# EAGLE schematic ESP32 Display-1.28-V1.0 (EAGLE 9.6.2)
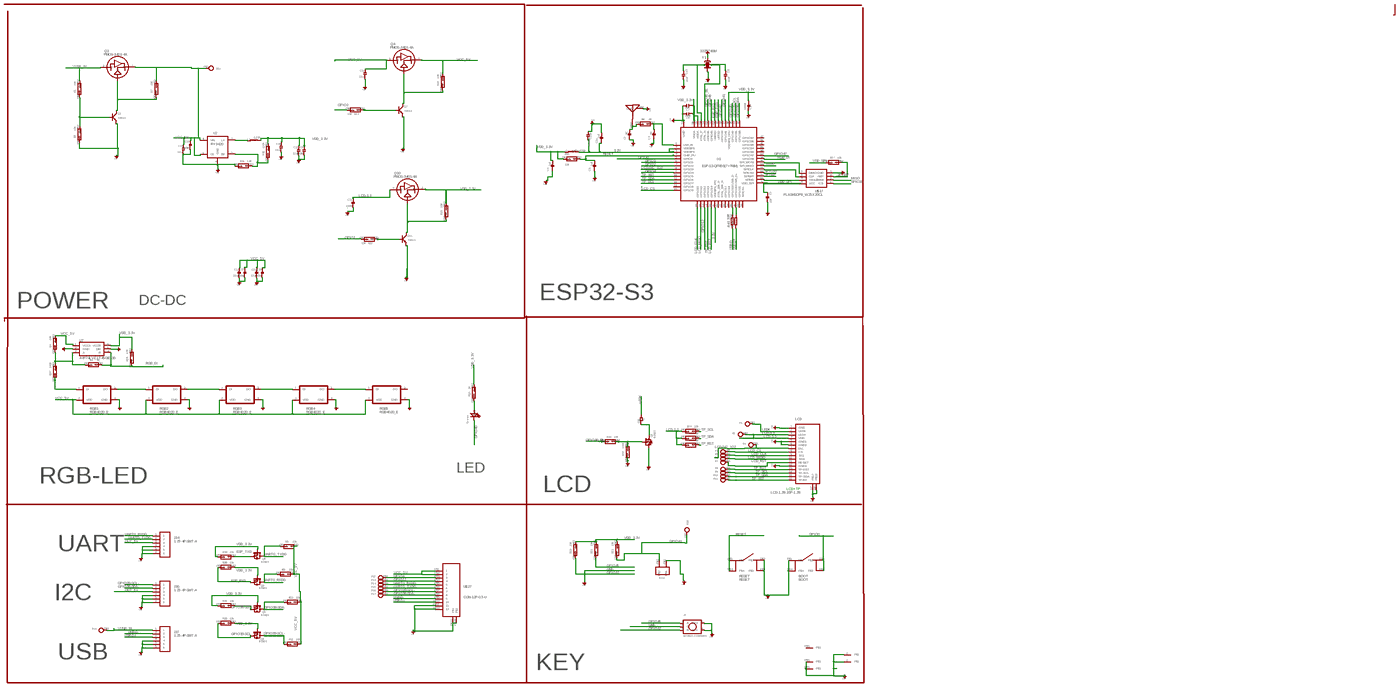
[diagram p0: schematic, sheet 1, overview]
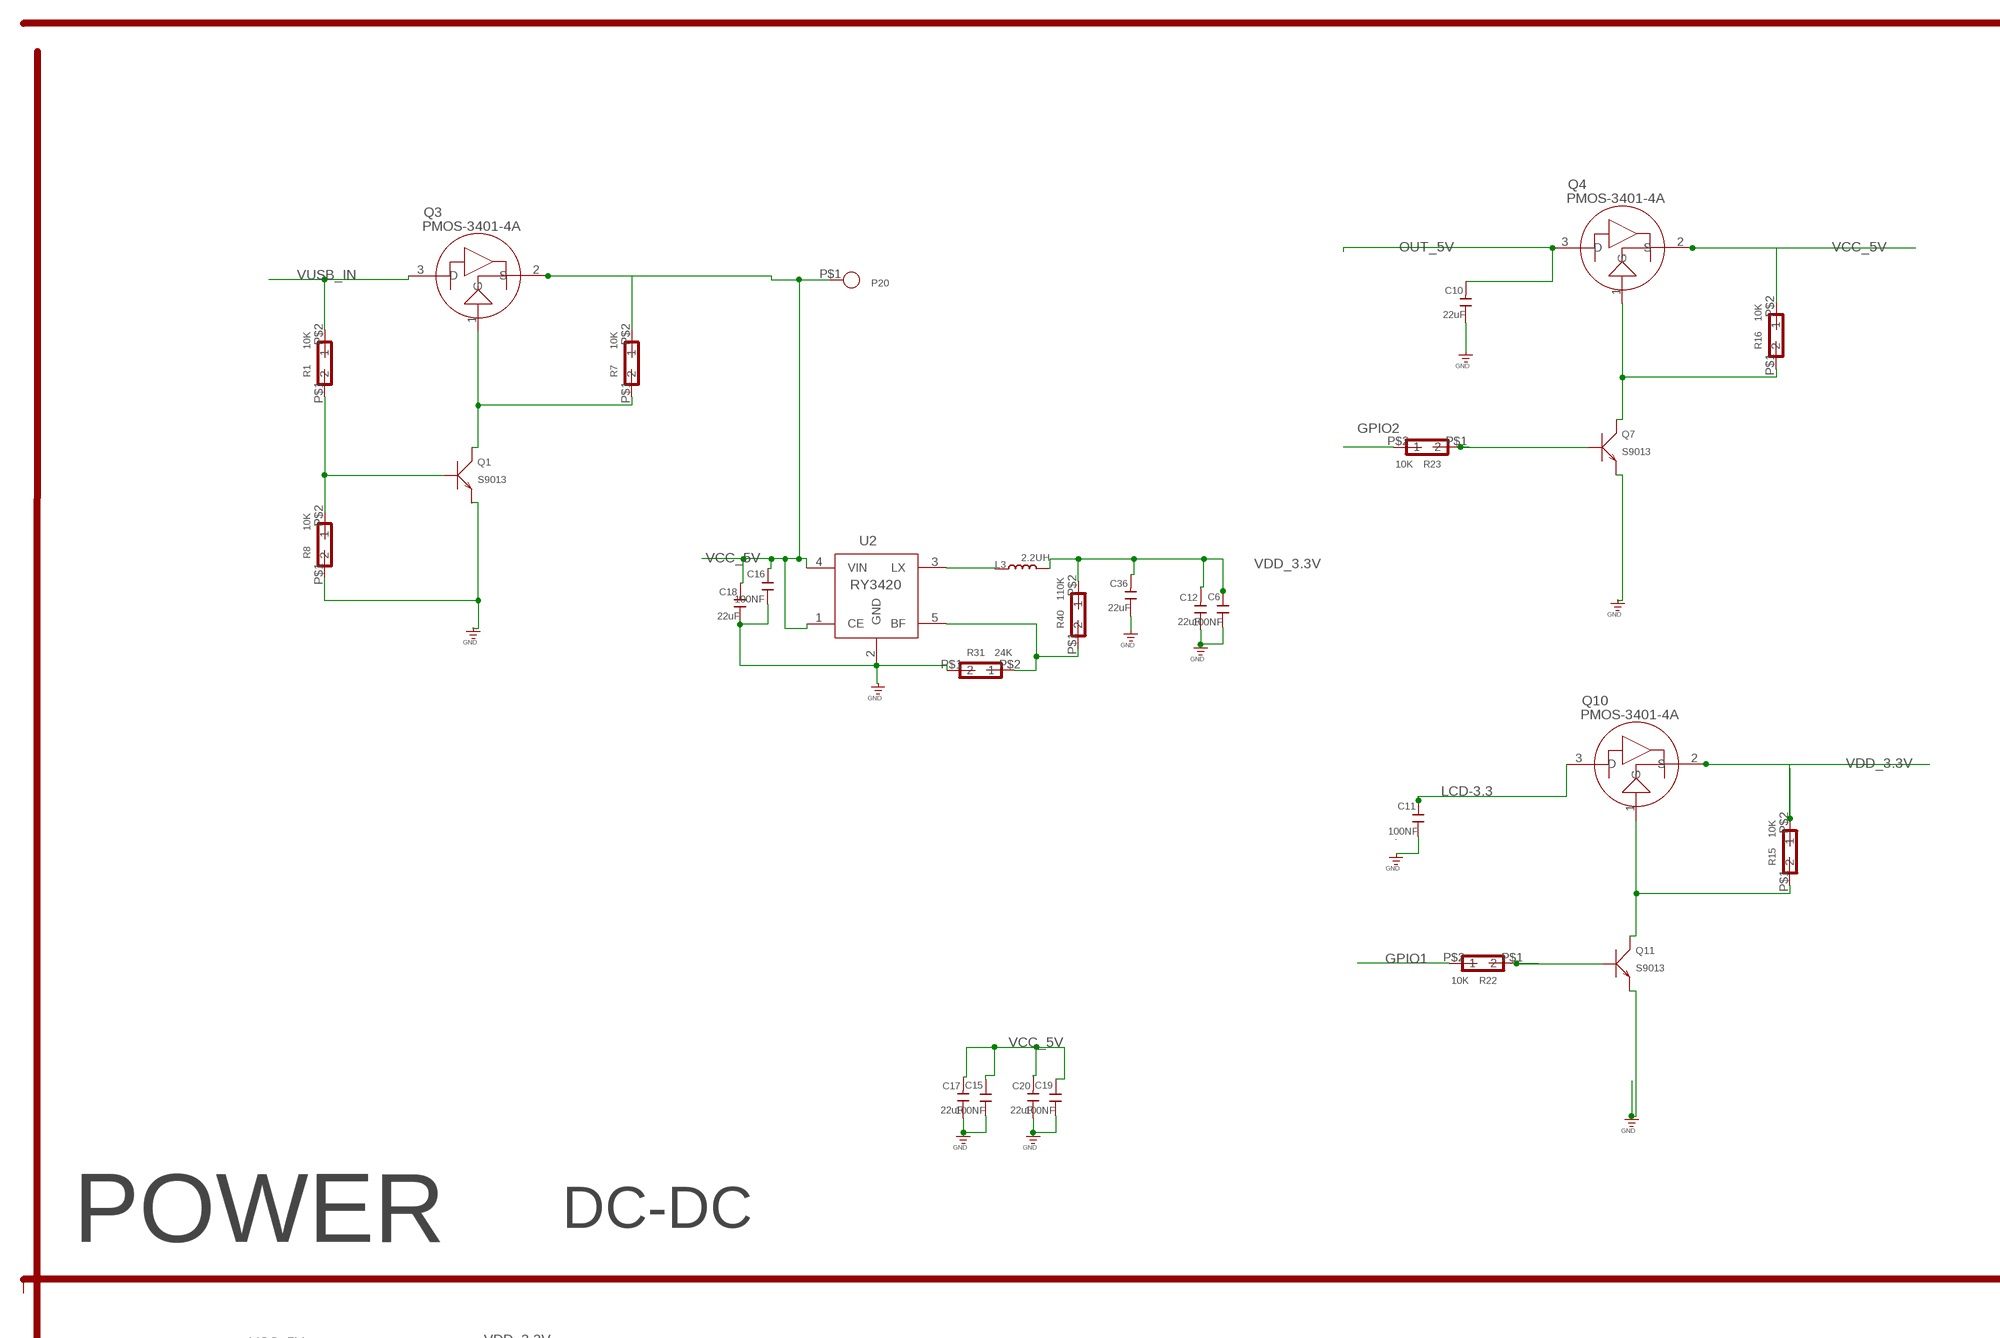
[diagram p1: schematic, sheet 1, part 1 of 5]
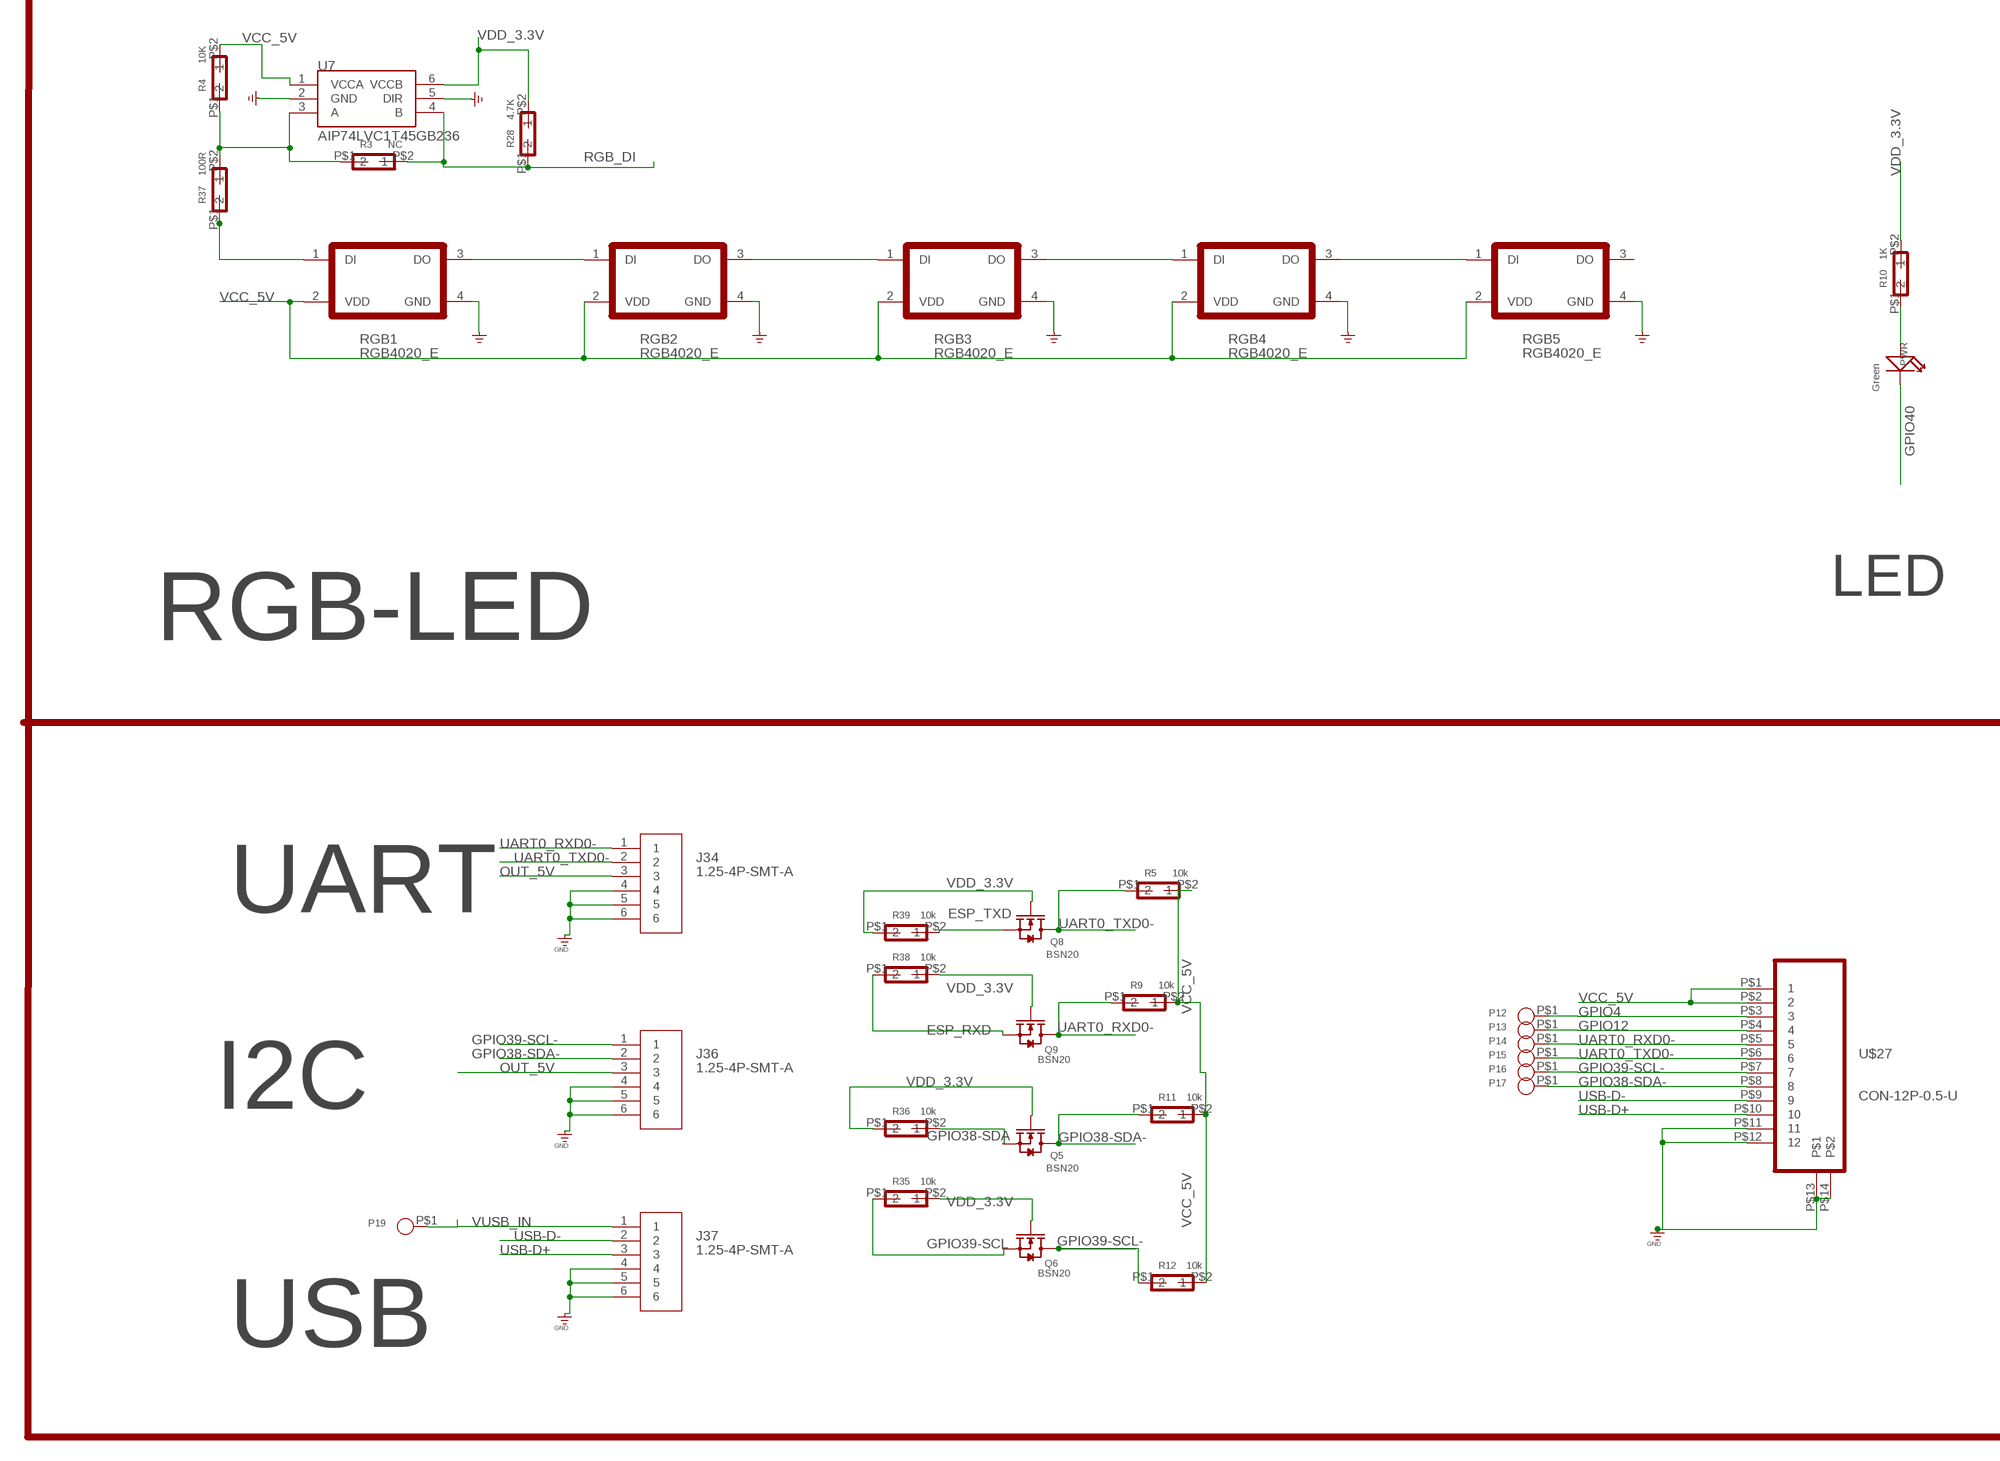
[diagram p2: schematic, sheet 1, part 2 of 5]
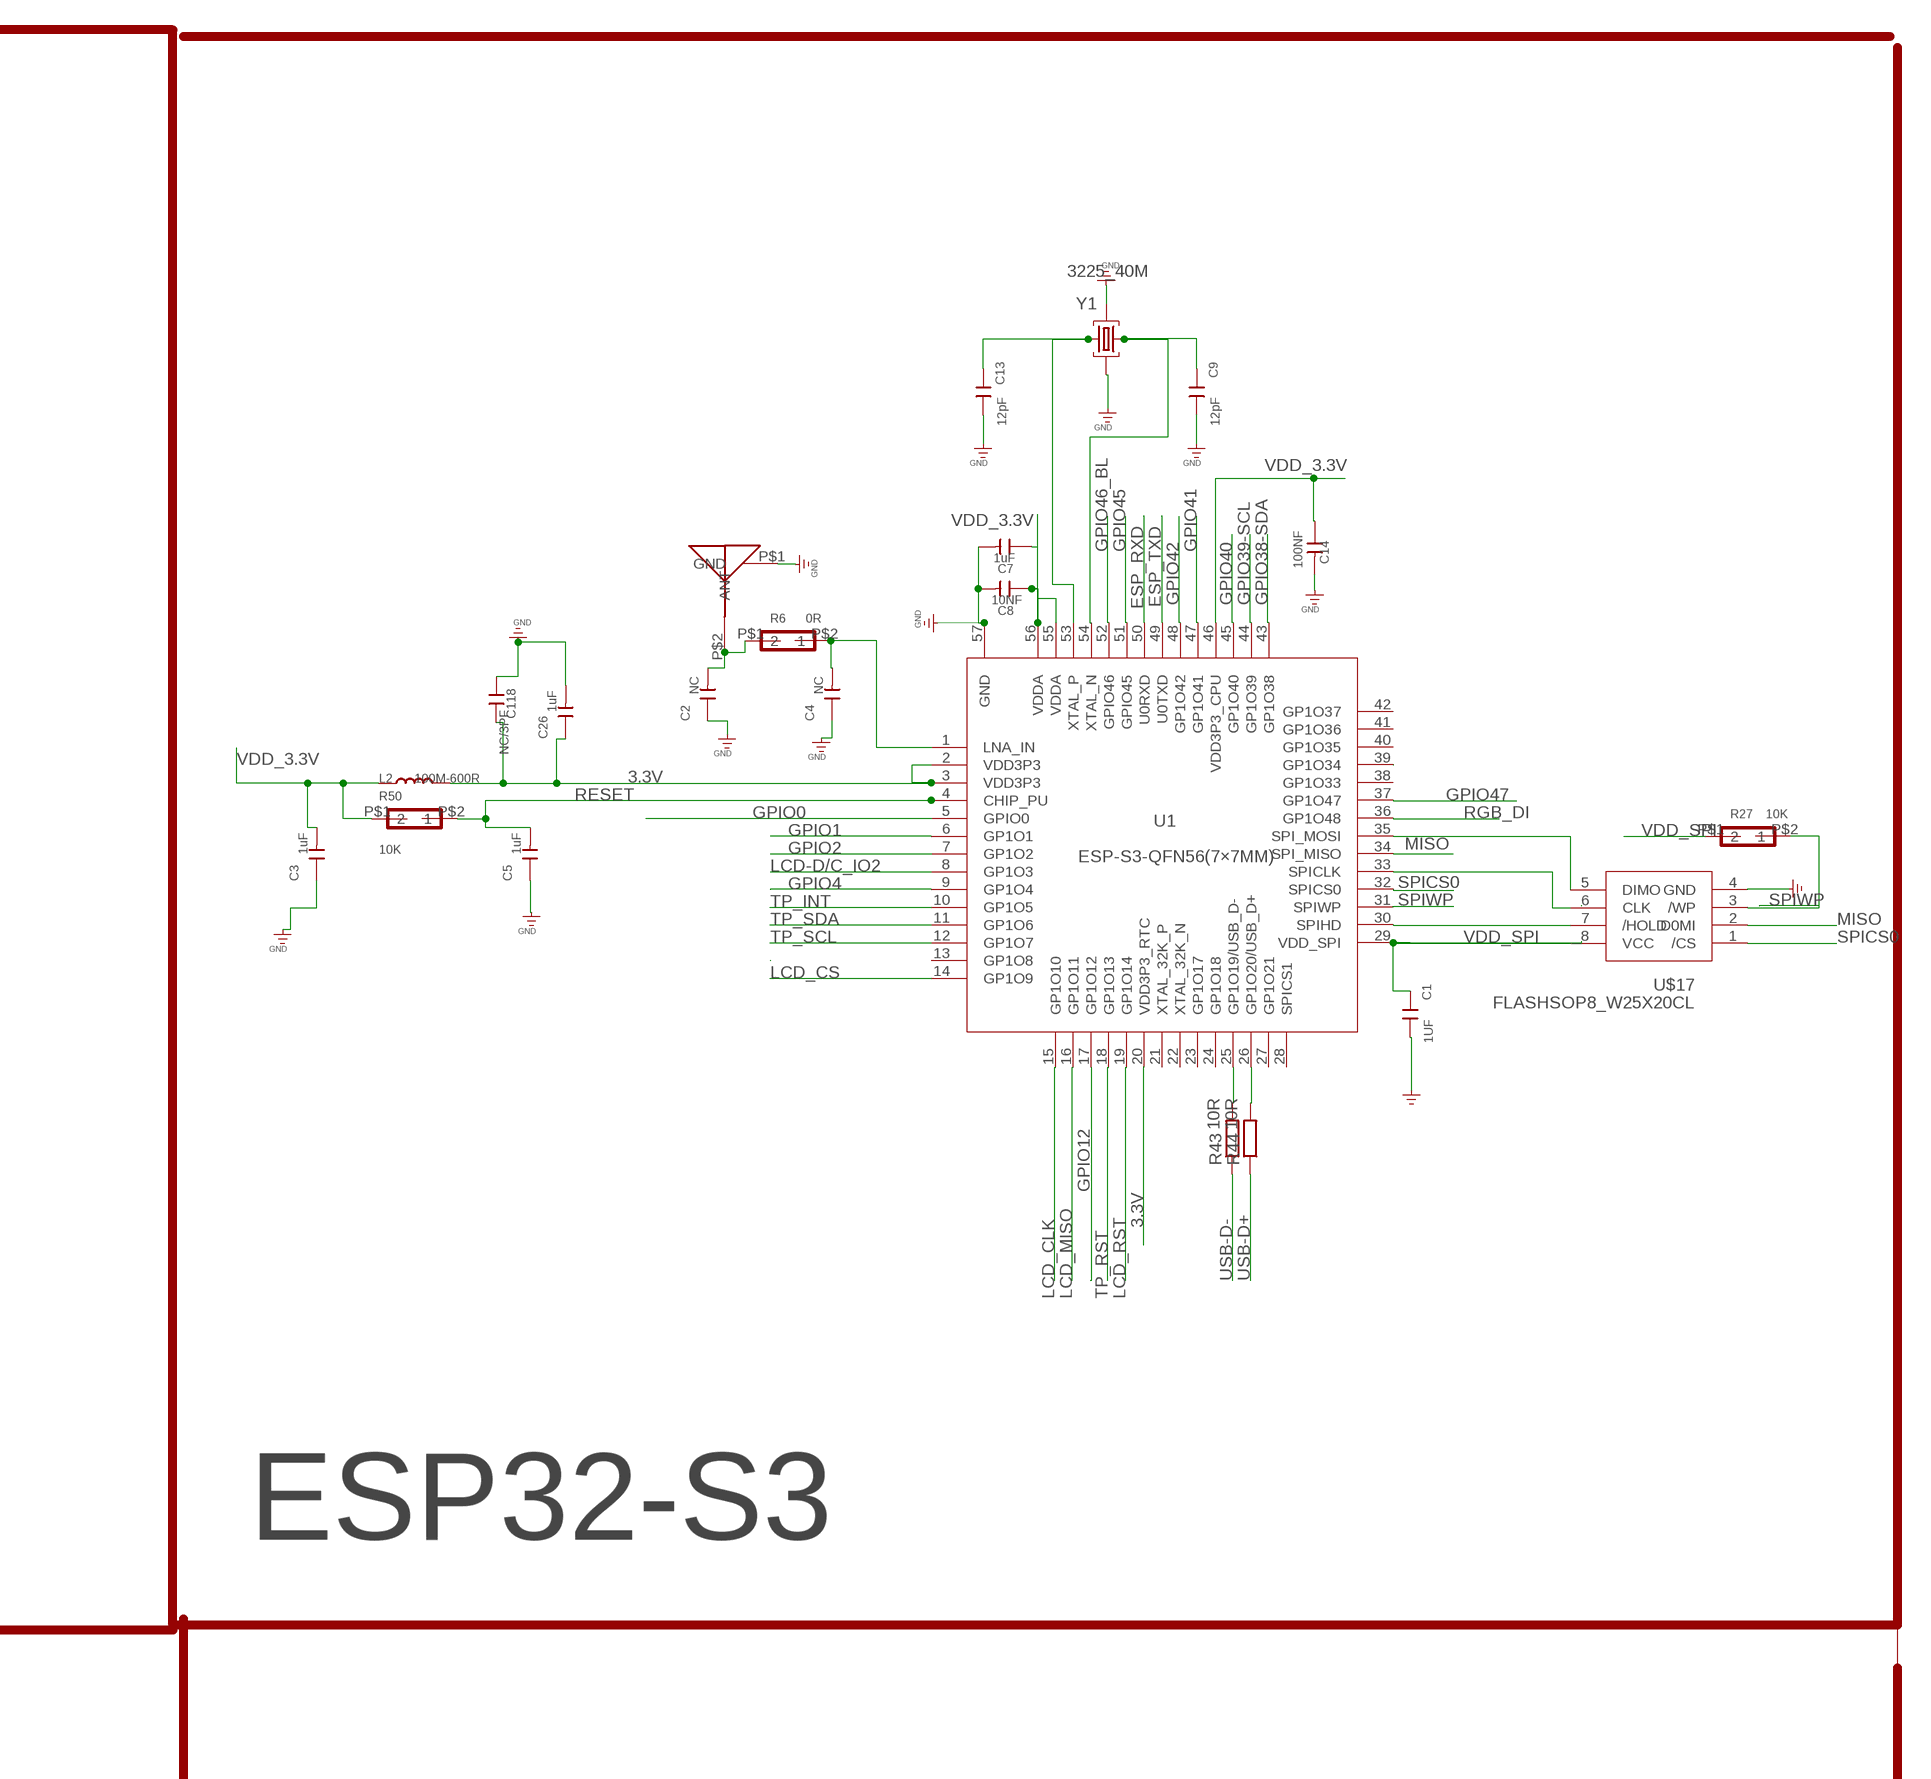
[diagram p3: schematic, sheet 1, part 3 of 5]
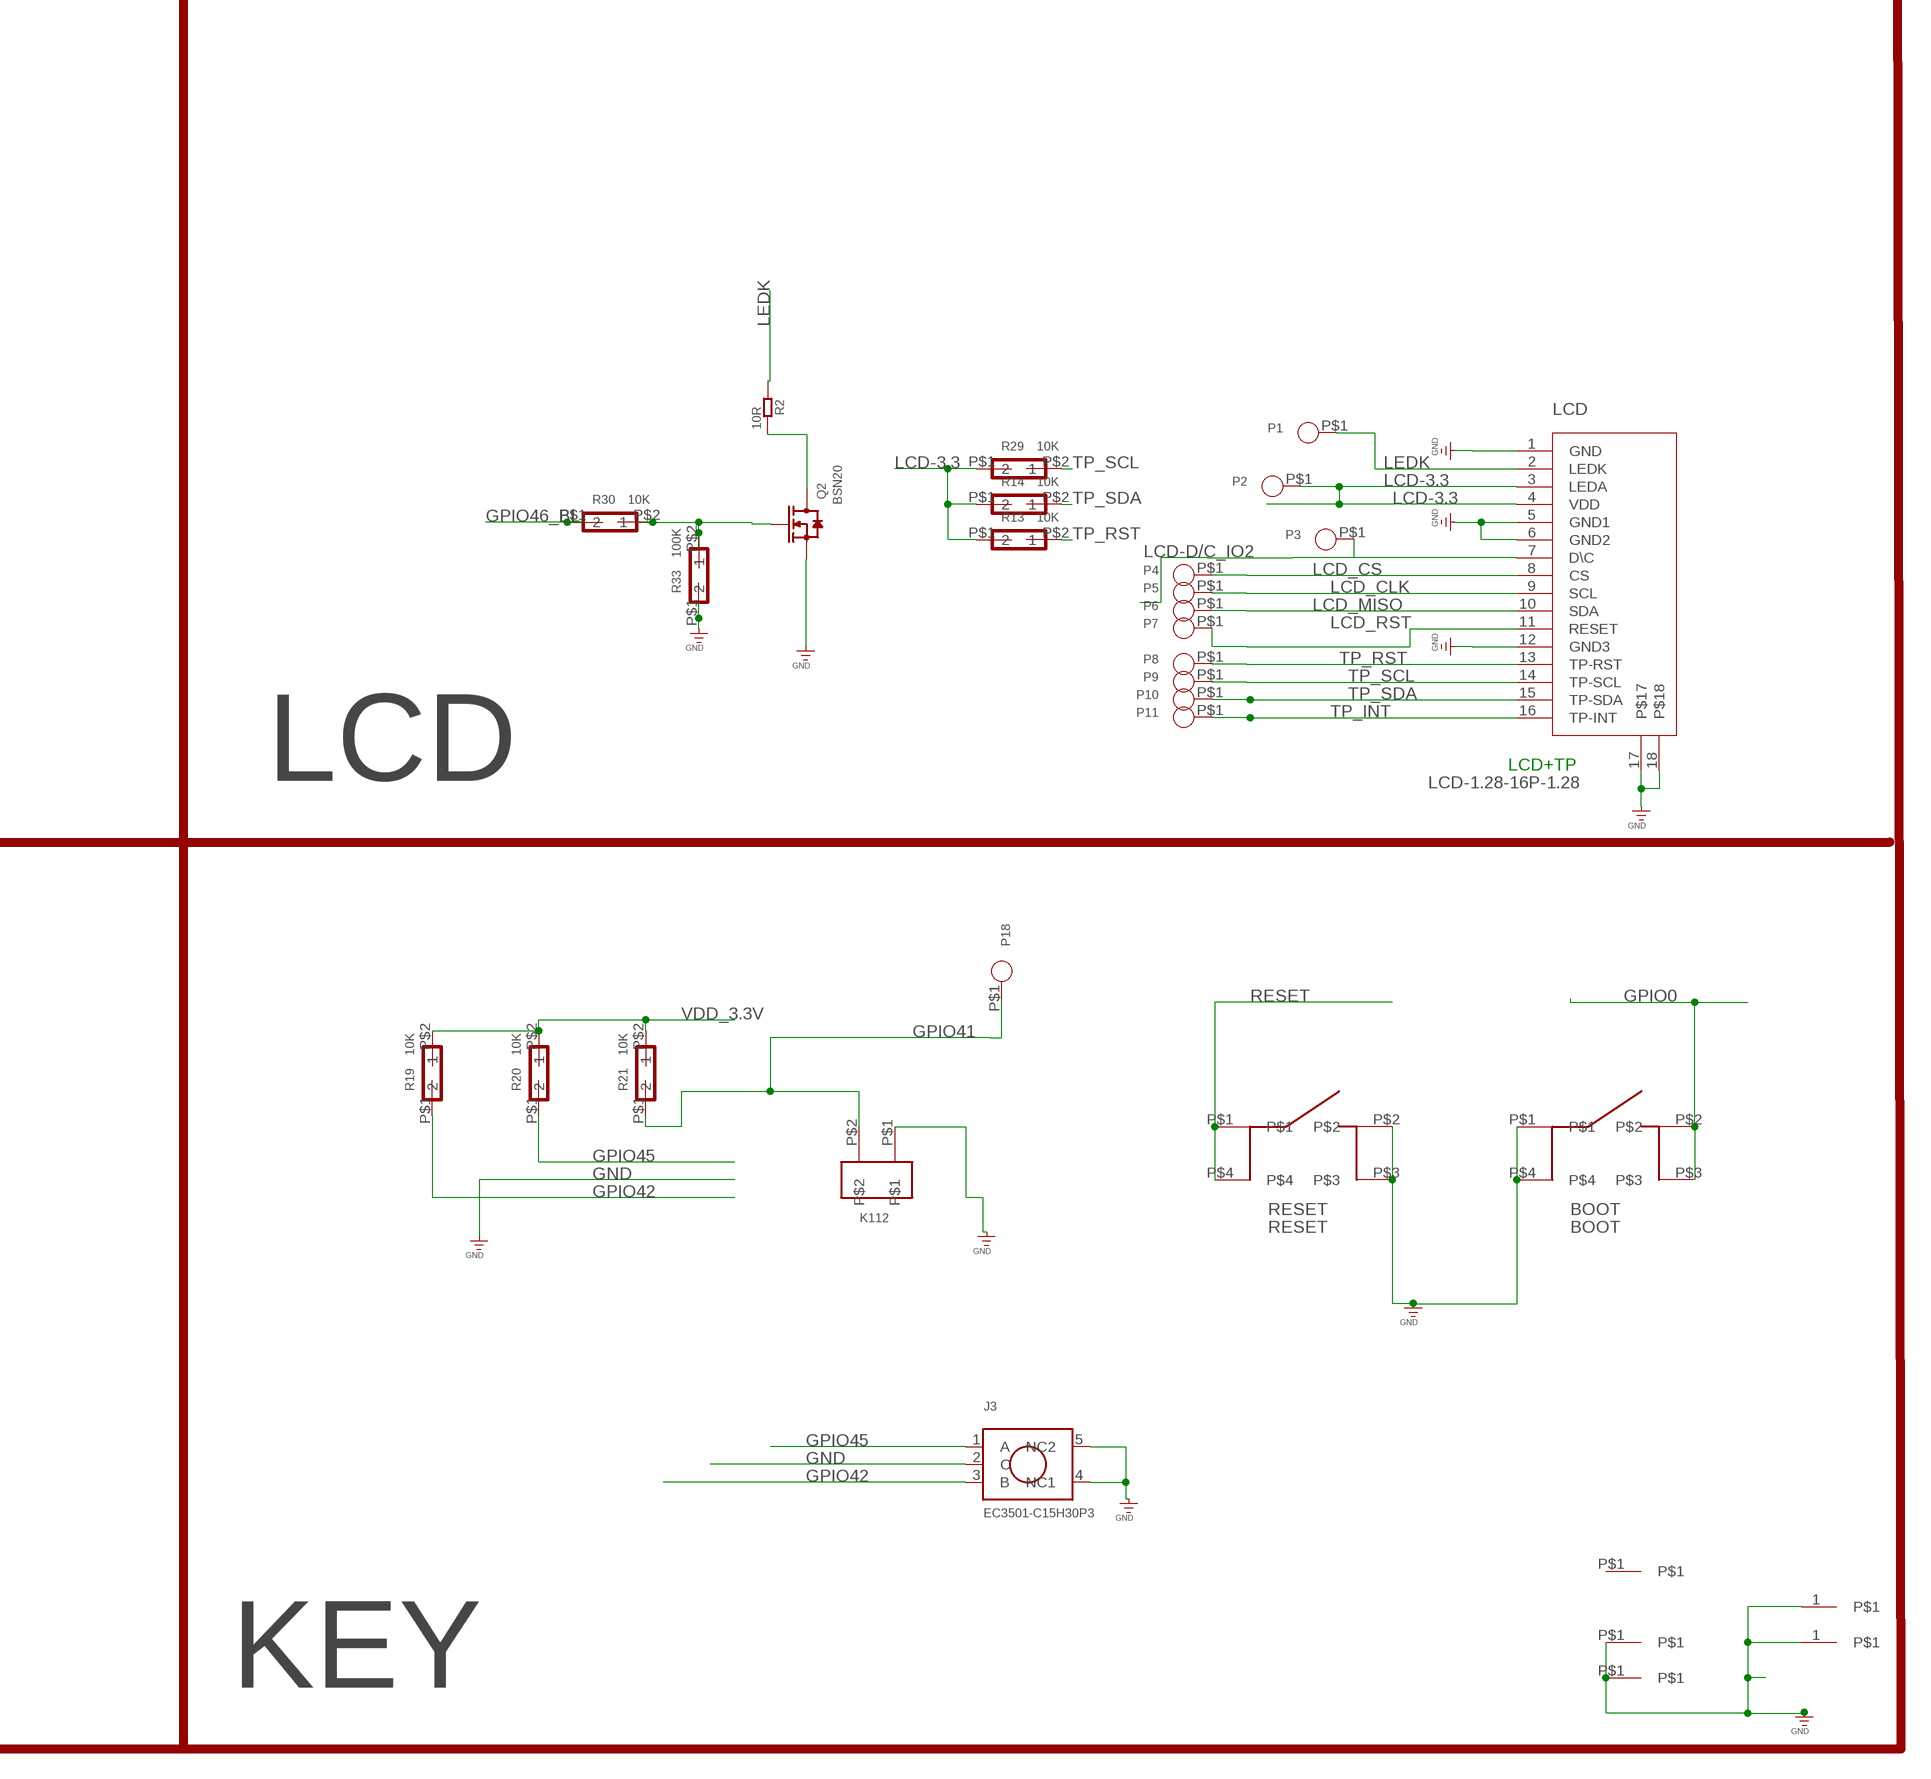
[diagram p4: schematic, sheet 1, part 4 of 5]
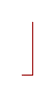
[diagram p5: schematic, sheet 1, part 5 of 5]

## Parts
ANT  BT_ANT  [BT_ANT]
BOOT  BOOT  SW-4  [SW-4.5*4.5]
C1  1UF  C0402_W  [0402]
C2  NC  CAPC0402-1  [C0402]
C3  1uF  CAPC0402-1  [C0402]
C4  NC  CAPC0402-1  [C0402]
C5  1uF  CAPC0402-1  [C0402]
C6  100NF  C0603  [0603]
C7  1uF  C-0603  [C0603]
C8  10NF  C-0603  [C0603]
C9  12pF  C0402_W  [0402]
C10  22uF  C0805  [0805]
C11  100NF  C0603  [0603]
C12  22uF  C0805  [0805]
C13  12pF  C0402_W  [0402]
C14  100NF  C-0603  [C0603]
C15  100NF  C0603  [0603]
C16  100NF  C0603  [0603]
C17  22uF  C0805  [0805]
C18  22uF  C0805  [0805]
C19  100NF  C0603  [0603]
C20  22uF  C0805  [0805]
C26  1uF  CAPC0402-1  [C0402]
C36  22uF  C0805  [0805]
C118  NC/3PF  C0603  [0603]
J3  EC3501-C15H30P3  [EC3501-C15H30P3]
J34  1.25-4P-SMT-A  [1.25-4P立贴]
J36  1.25-4P-SMT-A  [1.25-4P立贴]
J37  1.25-4P-SMT-A  [1.25-4P立贴]
K112  BUTTON_2P  [BUTTON_2P]
L2  100M-600R  L0603  [L0603]
L3  2.2UH  LL0420  [L0420]
LCD  LCD-1.28-16P-1.28  [0.5MM-16P]
P1  PADPAD-1.0MM  [PAD-1.0MM]
P2  PADPAD-1.0MM  [PAD-1.0MM]
P3  PADPAD-1.0MM  [PAD-1.0MM]
P4  PADPAD-1.0MM  [PAD-1.0MM]
P5  PADPAD-1.0MM  [PAD-1.0MM]
P6  PADPAD-1.0MM  [PAD-1.0MM]
P7  PADPAD-1.0MM  [PAD-1.0MM]
P8  PADPAD-1.0MM  [PAD-1.0MM]
P9  PADPAD-1.0MM  [PAD-1.0MM]
P10  PADPAD-1.0MM  [PAD-1.0MM]
P11  PADPAD-1.0MM  [PAD-1.0MM]
P12  PADPAD-1.0MM  [PAD-1.0MM]
P13  PADPAD-1.0MM  [PAD-1.0MM]
P14  PADPAD-1.0MM  [PAD-1.0MM]
P15  PADPAD-1.0MM  [PAD-1.0MM]
P16  PADPAD-1.0MM  [PAD-1.0MM]
P17  PADPAD-1.0MM  [PAD-1.0MM]
P18  PADPAD-1.0MM  [PAD-1.0MM]
P19  PADPAD-1.0MM  [PAD-1.0MM]
P20  PADPAD-1.0MM  [PAD-1.0MM]
PWR  Green  LED'0603'  [LED-0603]
Q1  S9013  TRANSISTOR-NPN-SOT23  [SOT23@1]
Q2  BSN20  MOSFET-N'SOT23'  [SOT23]
Q3  PMOS-3401-4A  P-MOS-SOT23  [SOT-23]
Q4  PMOS-3401-4A  P-MOS-SOT23  [SOT-23]
Q5  BSN20  MOSFET-N'SOT23'  [SOT23]
Q6  BSN20  MOSFET-N'SOT23'  [SOT23]
Q7  S9013  TRANSISTOR-NPN-SOT23  [SOT23@1]
Q8  BSN20  MOSFET-N'SOT23'  [SOT23]
Q9  BSN20  MOSFET-N'SOT23'  [SOT23]
Q10  PMOS-3401-4A  P-MOS-SOT23  [SOT-23]
Q11  S9013  TRANSISTOR-NPN-SOT23  [SOT23@1]
R1  10K  R0402  [0402]
R2  10R  R0603  [R0603]
R3  NC  R0402  [0402]
R4  10K  R0402  [0402]
R5  10k  R0402  [0402]
R6  0R  R0402  [0402]
R7  10K  R0402  [0402]
R8  10K  R0402  [0402]
R9  10k  R0402  [0402]
R10  1K  R0402  [0402]
R11  10k  R0402  [0402]
R12  10k  R0402  [0402]
R13  10K  R0402  [0402]
R14  10K  R0402  [0402]
R15  10K  R0402  [0402]
R16  10K  R0402  [0402]
R19  10K  R0402  [0402]
R20  10K  R0402  [0402]
R21  10K  R0402  [0402]
R22  10K  R0402  [0402]
R23  10K  R0402  [0402]
R27  10K  R0402  [0402]
R28  4.7K  R0402  [0402]
R29  10K  R0402  [0402]
R30  10K  R0402  [0402]
R31  24K  R0402  [0402]
R33  100K  R0402  [0402]
R35  10k  R0402  [0402]
R36  10k  R0402  [0402]
R37  100R  R0402  [0402]
R38  10k  R0402  [0402]
R39  10k  R0402  [0402]
R40  110K  R0402  [0402]
R43  10R  R-EU_R0402  [R0402]
R44  10R  R-EU_R0402  [R0402]
R50  10K  R0402  [0402]
RESET  RESET  SW-4  [SW-4.5*4.5]
RGB1  RGB4020_E  [RGB4020]
RGB2  RGB4020_E  [RGB4020]
RGB3  RGB4020_E  [RGB4020]
RGB4  RGB4020_E  [RGB4020]
RGB5  RGB4020_E  [RGB4020]
T1  T2.5-A  [T-2.5]
T2  T2.5-A  [T-2.5]
U1  ESP-S3-QFN56(7×7MM)  [ESP-S3-QFN56(7×7MM)]
U2  RY3420  HX3406  [SOT23-5]
U7  AIP74LVC1T45GB236  [SOT23-6L]
U$17  FLASHSOP8_W25X20CL  [FLASHSOP8_SOP8]
U$27  CON-12P-0.5-U  [CON-0.5-12P-U]
U$28  T-2-1.1  [T-2-1.1]
U$30  T-2-1.1  [T-2-1.1]
U$31  T-2-1.1  [T-2-1.1]
Y1  3225_40M  CRYSTAL-3.2-2.5  [CRYSTAL-3.2-2.5]

## Nets
3.3V: C26.1 C118.2 L2.2 U1.2(VDD3P3) U1.3(VDD3P3) U1.20(VDD3P3_RTC)
ESP_RXD: Q9.2(S) R38.P$1 U1.50(U0RXD)
ESP_TXD: Q8.2(S) R39.P$2 U1.49(U0TXD)
GND: ANT.P$1(GND) BOOT.P$1 BOOT.P$4 C1.2 C2.1 C3.1 C4.1 C5.1 C6.2 C7.2 C8.2 C9.2 C10.1 C11.2 C12.1 C13.2 C14.2 C15.2 C16.2 C17.1 C18.1 C19.2 C20.1 C26.2 C36.1 C118.1 J3.2(C) J3.4(NC1) J3.5(NC2) J34.4 J34.5 J34.6 J36.4 J36.5 J36.6 J37.4 J37.5 J37.6 K112.P$1 LCD.1(GND) LCD.5(GND1) LCD.6(GND2) LCD.12(GND3) LCD.17 LCD.18 Q1.2(E) Q2.2(S) Q7.2(E) Q11.2(E) R8.P$1 R31.P$1 R33.P$1 RESET.P$2 RESET.P$3 RGB1.4(GND) RGB2.4(GND) RGB3.4(GND) RGB4.4(GND) RGB5.4(GND) T1.1 T2.1 U1.57(GND) U2.2(GND) U7.2(GND) U7.5(DIR) U$17.4(GND) U$27.P$11 U$27.P$12 U$27.P$13 U$27.P$14 U$28.P$1 U$31.P$1 Y1.2(GND) Y1.4(GND)
GPIO0: BOOT.P$2 BOOT.P$3 U1.5(GPIO0)
GPIO1: R22.P$2 U1.6(GP1O1)
GPIO2: R23.P$2 U1.7(GP1O2)
GPIO4: P12.P$1 U1.9(GP1O4) U$27.P$3
GPIO12: P13.P$1 U1.17(GP1O12) U$27.P$4
GPIO34: U1.39(GP1O34)
GPIO37: U1.42(GP1O37)
GPIO38-SDA: Q5.2(S) R36.P$2 U1.43(GP1O38)
GPIO38-SDA-: J36.2 P17.P$1 Q5.3(D) R11.P$1 U$27.P$8
GPIO39-SCL: Q6.2(S) R35.P$1 U1.44(GP1O39)
GPIO39-SCL-: J36.1 P16.P$1 Q6.3(D) R12.P$1 U$27.P$7
GPIO40: PWR.- U1.45(GP1O40)
GPIO41: K112.P$2 P18.P$1 R21.P$1 U1.47(GP1O41)
GPIO42: J3.3(B) R19.P$1 U1.48(GP1O42)
GPIO45: J3.1(A) R20.P$1 U1.51(GPIO45)
GPIO46_BL: R30.P$1 U1.52(GPIO46)
GPIO47: U1.37(GP1O47)
LCD-3.3: C11.1 LCD.3(LEDA) LCD.4(VDD) P2.P$1 Q10.3(D) R13.P$1 R14.P$1 R29.P$1
LCD-D/C_IO2: LCD.7(D\C) P3.P$1 U1.8(GP1O3)
LCD_CLK: LCD.9(SCL) P5.P$1 U1.15(GP1O10)
LCD_CS: LCD.8(CS) P4.P$1 U1.14(GP1O9)
LCD_MISO: LCD.10(SDA) P6.P$1 U1.16(GP1O11)
LCD_RST: LCD.11(RESET) P7.P$1 U1.19(GP1O14)
LEDK: LCD.2(LEDK) P1.P$1 R2.2
MISO: U1.34(SPI_MISO) U$17.2(D0MI)
N$1: Q4.1(G) Q7.3(C) R16.P$1
N$2: RGB1.3(DO) RGB2.1(DI)
N$3: L3.1 U2.3(LX)
N$4: RGB2.3(DO) RGB3.1(DI)
N$5: PWR.+ R10.P$1
N$6: Q1.3(C) Q3.1(G) R7.P$1
N$7: ANT.P$2(ANT) C2.2 R6.P$1
N$8: RGB3.3(DO) RGB4.1(DI)
N$9: Q1.1(B) R1.P$1 R8.P$2
N$10: R43.2 U1.25(GP1O19/USB_D-)
N$13: Q2.3(D) R2.1
N$14: R31.P$2 R40.P$1 U2.5(BF)
N$15: Q2.1(G) R30.P$2 R33.P$2
N$16: R44.2 U1.26(GP1O20/USB_D+)
N$17: R3.P$1 R4.P$1 R37.P$2 U7.3(A)
N$18: R37.P$1 RGB1.1(DI)
N$19: U1.35(SPI_MOSI) U$17.5(DIMO)
N$21: U1.33(SPICLK) U$17.6(CLK)
N$22: RGB4.3(DO) RGB5.1(DI)
N$23: U1.30(SPIHD) U$17.7(/HOLD)
N$26: Q10.1(G) Q11.3(C) R15.P$1
N$29: Q11.1(B) R22.P$1
N$30: Q7.1(B) R23.P$1
N$198: C4.2 R6.P$2 U1.1(LNA_IN)
N$201: C13.1 U1.53(XTAL_P) Y1.3(C2)
N$202: C9.1 U1.54(XTAL_N) Y1.1(C1)
OUT_5V: C10.2 J34.3 J36.3 Q4.3(D)
RESET: C5.2 R50.P$2 RESET.P$1 RESET.P$4 U1.4(CHIP_PU)
RGB_DI: R3.P$2 R28.P$1 U1.36(GP1O48) U7.4(B)
SPICS0: U1.32(SPICS0) U$17.1(/CS)
SPIWP: R27.P$2 U1.31(SPIWP) U$17.3(/WP)
TP_INT: LCD.16(TP-INT) P11.P$1 U1.10(GP1O5)
TP_RST: LCD.13(TP-RST) P8.P$1 R13.P$2 U1.18(GP1O13)
TP_SCL: LCD.14(TP-SCL) P9.P$1 R29.P$2 U1.12(GP1O7)
TP_SDA: LCD.15(TP-SDA) P10.P$1 R14.P$2 U1.11(GP1O6)
UART0_RXD0-: J34.1 P14.P$1 Q9.3(D) R9.P$1 U$27.P$5
UART0_TXD0-: J34.2 P15.P$1 Q8.3(D) R5.P$1 U$27.P$6
USB-D+: J37.3 R44.1 U$27.P$10
USB-D-: J37.2 R43.1 U$27.P$9
VCC_5V [PWR]: C15.1 C16.1 C17.2 C18.2 C19.1 C20.2 P20.P$1 Q3.2(S) Q4.2(S) R4.P$2 R5.P$2 R7.P$2 R9.P$2 R11.P$2 R12.P$2 R16.P$2 RGB1.2(VDD) RGB2.2(VDD) RGB3.2(VDD) RGB4.2(VDD) RGB5.2(VDD) U2.1(CE) U2.4(VIN) U7.1(VCCA) U$27.P$1 U$27.P$2
VDD_3.3V: C3.2 C6.1 C7.1 C8.1 C12.2 C14.1 C36.2 L2.1 L3.2 Q5.1(G) Q6.1(G) Q8.1(G) Q9.1(G) Q10.2(S) R10.P$2 R15.P$2 R19.P$2 R20.P$2 R21.P$2 R28.P$2 R35.P$2 R36.P$1 R38.P$2 R39.P$1 R40.P$2 R50.P$1 U1.46(VDD3P3_CPU) U1.55(VDDA) U1.56(VDDA) U7.6(VCCB)
VDD_SPI: C1.1 R27.P$1 U1.29(VDD_SPI) U$17.8(VCC)
VUSB_IN: J37.1 P19.P$1 Q3.3(D) R1.P$2
Unconnected: RGB5.3(DO) U1.13(GP1O8) U1.21(XTAL_32K_P) U1.22(XTAL_32K_N) U1.23(GP1O17) U1.24(GP1O18) U1.27(GP1O21) U1.28(SPICS1) U1.38(GP1O33) U1.40(GP1O35) U1.41(GP1O36) U$30.P$1

## Notes on the sheet
- ESP32-S3
- POWER | DC-DC
- LED
- RGB-LED
- LCD+TP
- LCD
- UART
- I2C
- USB
- KEY

## Library data of the parts
ANT = BT_ANT:BT_ANT
BOOT RESET = DW1000:SW-4
C1 C9 C13 = WGH:C0402_W
C2-C5 C26 = CrowPanel_Advance_HMI:CAP*
C6 C11 C15 C16 C19 C118 = cooper:C0603
C7 C8 C14 = Discrete:C*: Ceramic Capacitors
C10 C12 C17 C18 C20 C36 = A_xbj:C0805
J3 = ESP32_Display_K:EC3501-C15H30P3
J34 J36 J37 = DW1000:1.25-4P-SMT-A
K112 = crowpi_pow:BUTTON_2P
L2 L3 = Lora_RA-08H_Node_ Board:L*
LCD = DW1000:LCD-1.28-16P-1.28
P1-P20 = crowpi_pow:PAD*
PWR = discrete:LED*
Q1 Q7 Q11 = discrete:TRANSISTOR-NPN*: NPN audion
Q2 Q5 Q6 Q8 Q9 = discrete:MOSFET-N: IRLL014: http://www.vishay.com/docs/91319/sihll014.pdf
Q3 Q4 Q10 = DFN8:P-MOS-SOT23
R1 R3-R16 R19-R23 R27-R31 R33 R35-R40 R50 = DW1000:R0402
R2 = cooper:R0603
R43 R44 = rcl:R-EU_: RESISTOR, European symbol; SPICEPREFIX: R
RGB1-RGB5 = DW1000:RGB4020_E
T1 T2 = DW1000:T2.5-A
U1 = DA14580_40p:ESP-S3-QFN56(7×7MM)
U2 = DFN8:HX3406
U7 = Mechanical_Keyboard:AIP74LVC1T45GB236
U$17 = ESP32 Display-1.28:FLASHSOP8_W25X20CL
U$27 = DW1000:CON-12P-0.5-U
U$28 U$30 U$31 = DW1000:T-2-1.1
Y1 = SmartPrj:CRYSTAL-3.2-2.5

## Net classes
0 default: clearance 0.12 mm
1 PWR: width 0.254 mm, clearance 0.12 mm to class 0, clearance 0.12 mm